# EAGLE schematic LimitSwitches (EAGLE 8.1.1)
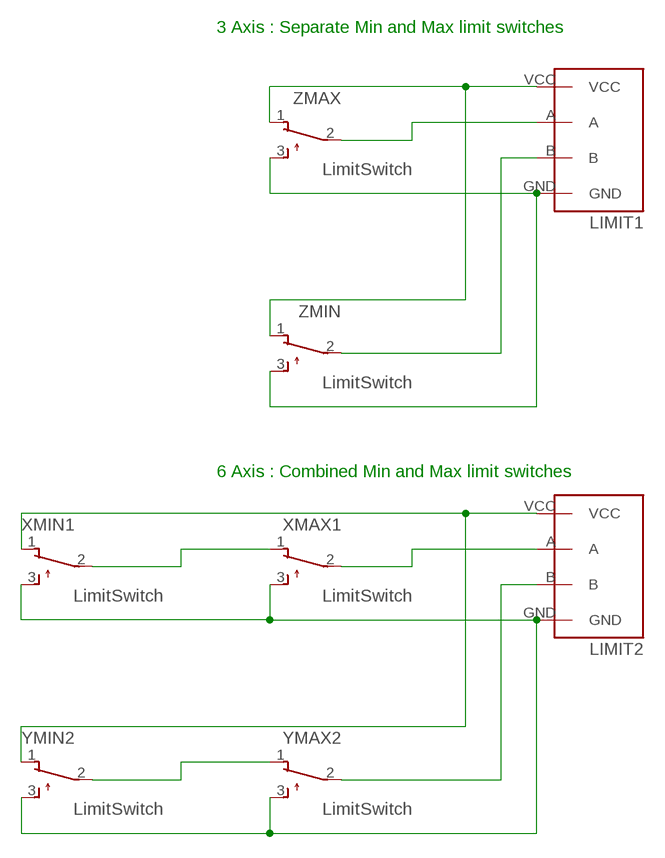
[diagram p0: schematic, sheet 1]

## Parts
LIMIT1  CONN4B  [CONN4B]
LIMIT2  CONN4B  [CONN4B]
XMAX1  LimitSwitch  TL32PO  [TL3XPO]
XMIN1  LimitSwitch  TL32PO  [TL3XPO]
YMAX2  LimitSwitch  TL32PO  [TL3XPO]
YMIN2  LimitSwitch  TL32PO  [TL3XPO]
ZMAX  LimitSwitch  TL32PO  [TL3XPO]
ZMIN  LimitSwitch  TL32PO  [TL3XPO]

## Nets
GND: LIMIT1.GND ZMAX.3(S) ZMIN.3(S)
GND1: LIMIT2.GND XMAX1.3(S) XMIN1.3(S) YMAX2.3(S) YMIN2.3(S)
N$1: LIMIT1.A ZMAX.2(P)
N$4: LIMIT1.B ZMIN.2(P)
N$5: XMAX1.1(O) XMIN1.2(P)
N$6: LIMIT2.A XMAX1.2(P)
N$7: YMAX2.1(O) YMIN2.2(P)
N$8: LIMIT2.B YMAX2.2(P)
VCC: LIMIT1.VCC ZMAX.1(O) ZMIN.1(O)
VCC1: LIMIT2.VCC XMIN1.1(O) YMIN2.1(O)

## Notes on the sheet
- 3 Axis : Separate Min and Max limit switches
- 6 Axis : Combined Min and Max limit switches

## Library data of the parts
LIMIT1 LIMIT2 = Mooov2:CONN4B
XMAX1 XMIN1 YMAX2 YMIN2 ZMAX ZMIN = switch:TL32PO: TINY SWITCH ON - MOM Source: http://www2.produktinfo.conrad.com/datenblaetter/700000-724999/705152-da-01-de-Subminiaturschalter_TL_36YO.pdf